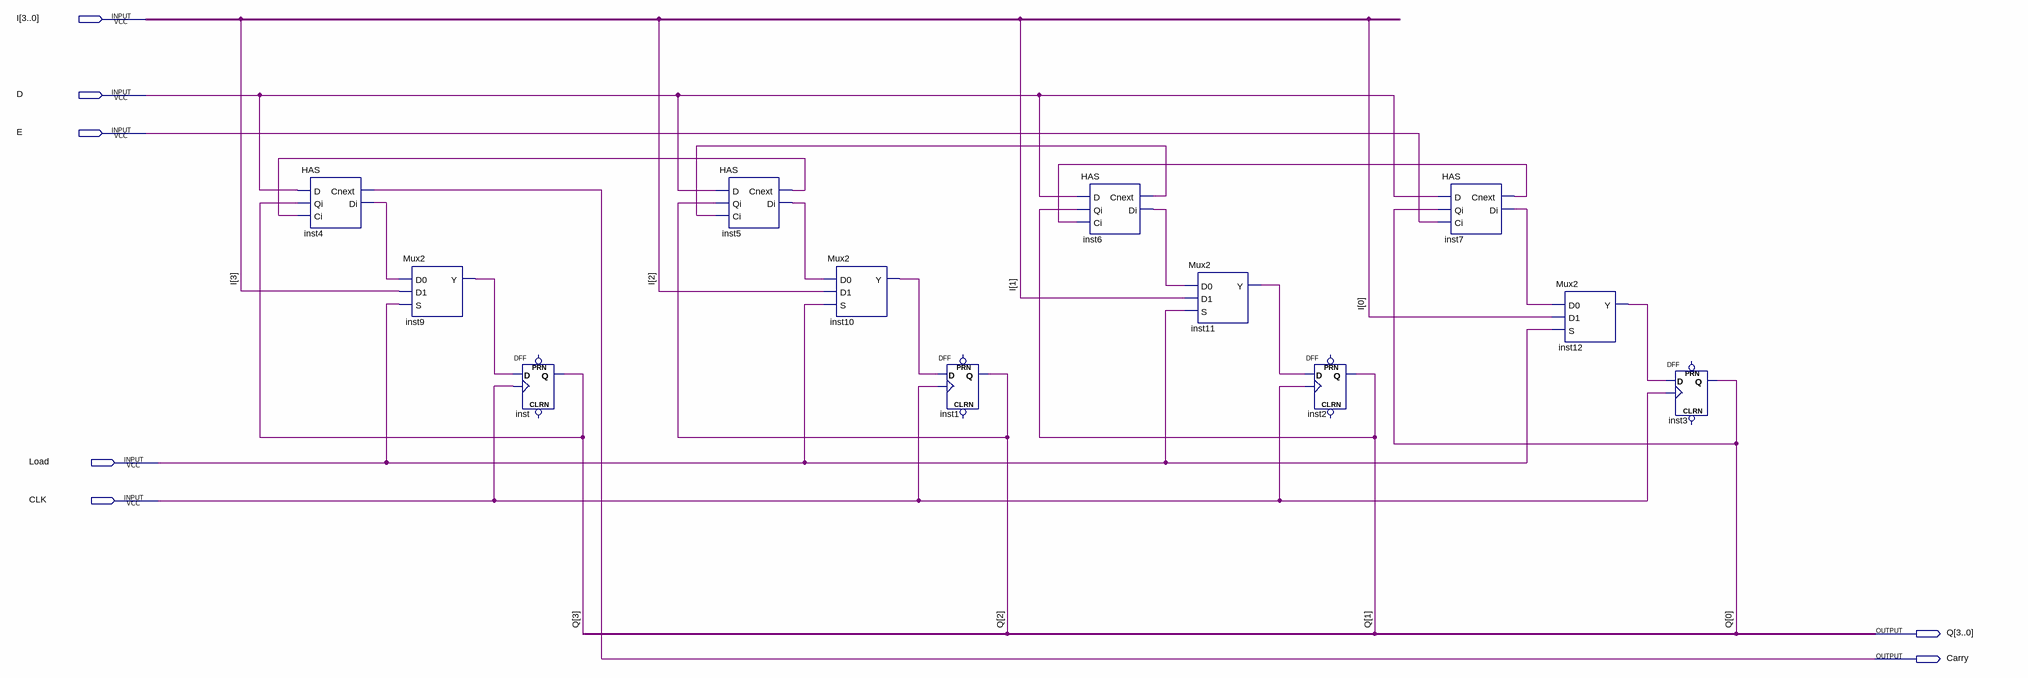
[diagram p0: schematic sheet]
// Quartus schematic counter.bdf as structural Verilog: 12 symbols, 7 pins
module counter (
  input  [3:0] I,
  input  D,
  input  E,
  input  Load,
  input  CLK,
  output [3:0] Q,
  output Carry
);

  wire inst4_di, inst5_cnext, inst5_di, inst6_cnext, inst6_di, inst7_cnext, inst7_di, inst9_y, inst10_y,
       inst11_y, inst12_y;

  HAS inst4 (.D(D), .Qi(Q[3]), .Ci(inst5_cnext), .Cnext(Carry), .Di(inst4_di));
  Mux2 inst9 (.D0(inst4_di), .D1(I[3]), .S(Load), .Y(inst9_y));
  DFF inst (.CLK(CLK), .D(inst9_y), .Q(Q[3]));  // open: CLRN, PRN
  HAS inst5 (.D(D), .Qi(Q[2]), .Ci(inst6_cnext), .Cnext(inst5_cnext), .Di(inst5_di));
  Mux2 inst10 (.D0(inst5_di), .D1(I[2]), .S(Load), .Y(inst10_y));
  DFF inst1 (.CLK(CLK), .D(inst10_y), .Q(Q[2]));  // open: CLRN, PRN
  HAS inst6 (.D(D), .Qi(Q[1]), .Ci(inst7_cnext), .Cnext(inst6_cnext), .Di(inst6_di));
  Mux2 inst11 (.D0(inst6_di), .D1(I[1]), .S(Load), .Y(inst11_y));
  DFF inst2 (.CLK(CLK), .D(inst11_y), .Q(Q[1]));  // open: CLRN, PRN
  HAS inst7 (.D(D), .Qi(Q[0]), .Ci(E), .Cnext(inst7_cnext), .Di(inst7_di));
  Mux2 inst12 (.D0(inst7_di), .D1(I[0]), .S(Load), .Y(inst12_y));
  DFF inst3 (.CLK(CLK), .D(inst12_y), .Q(Q[0]));  // open: CLRN, PRN
endmodule
